# EAGLE schematic Wio LTE Cat NB1 v1.02 (EAGLE 6.4)
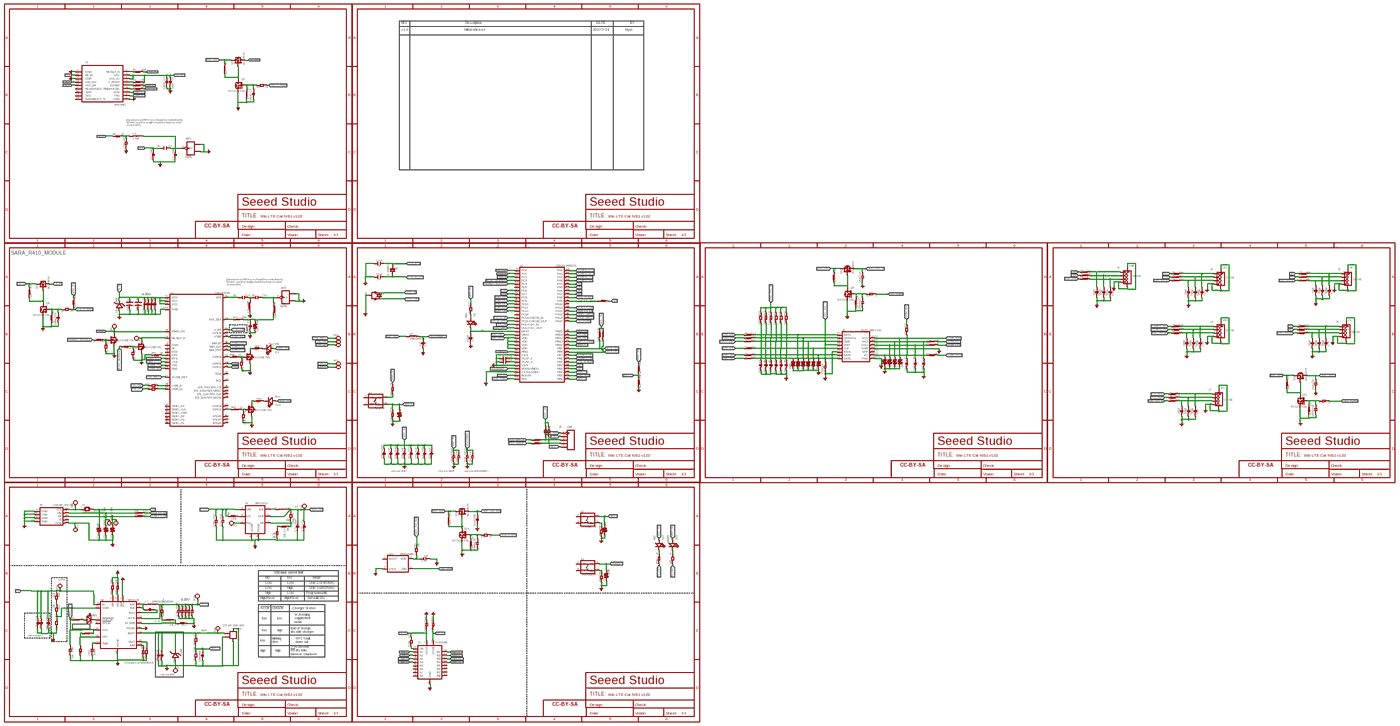
[diagram p0: schematic, sheet 1, overview]
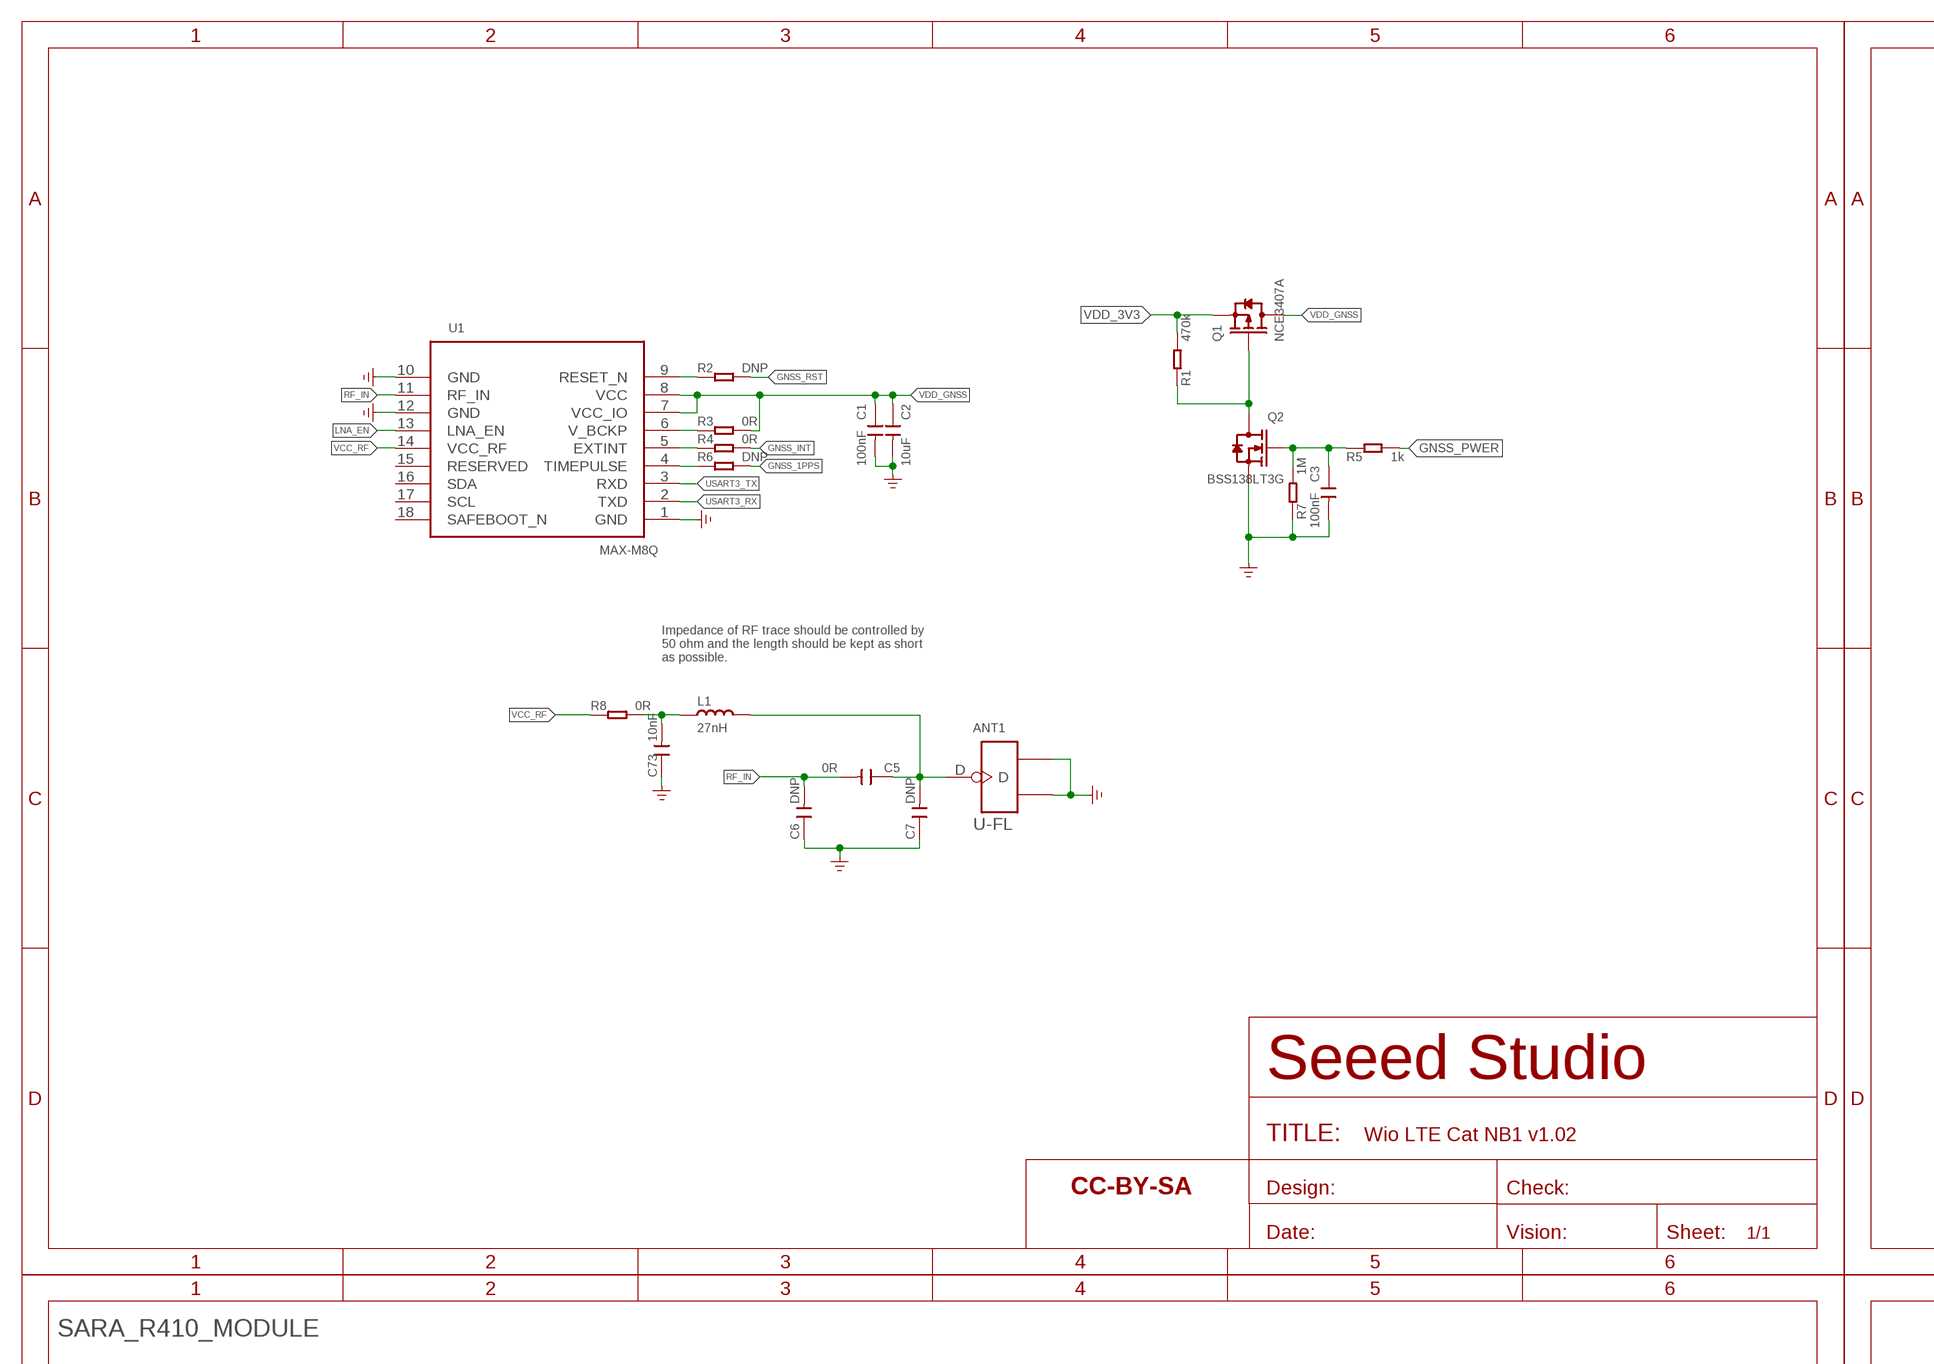
[diagram p1: schematic, sheet 1, part 1 of 6]
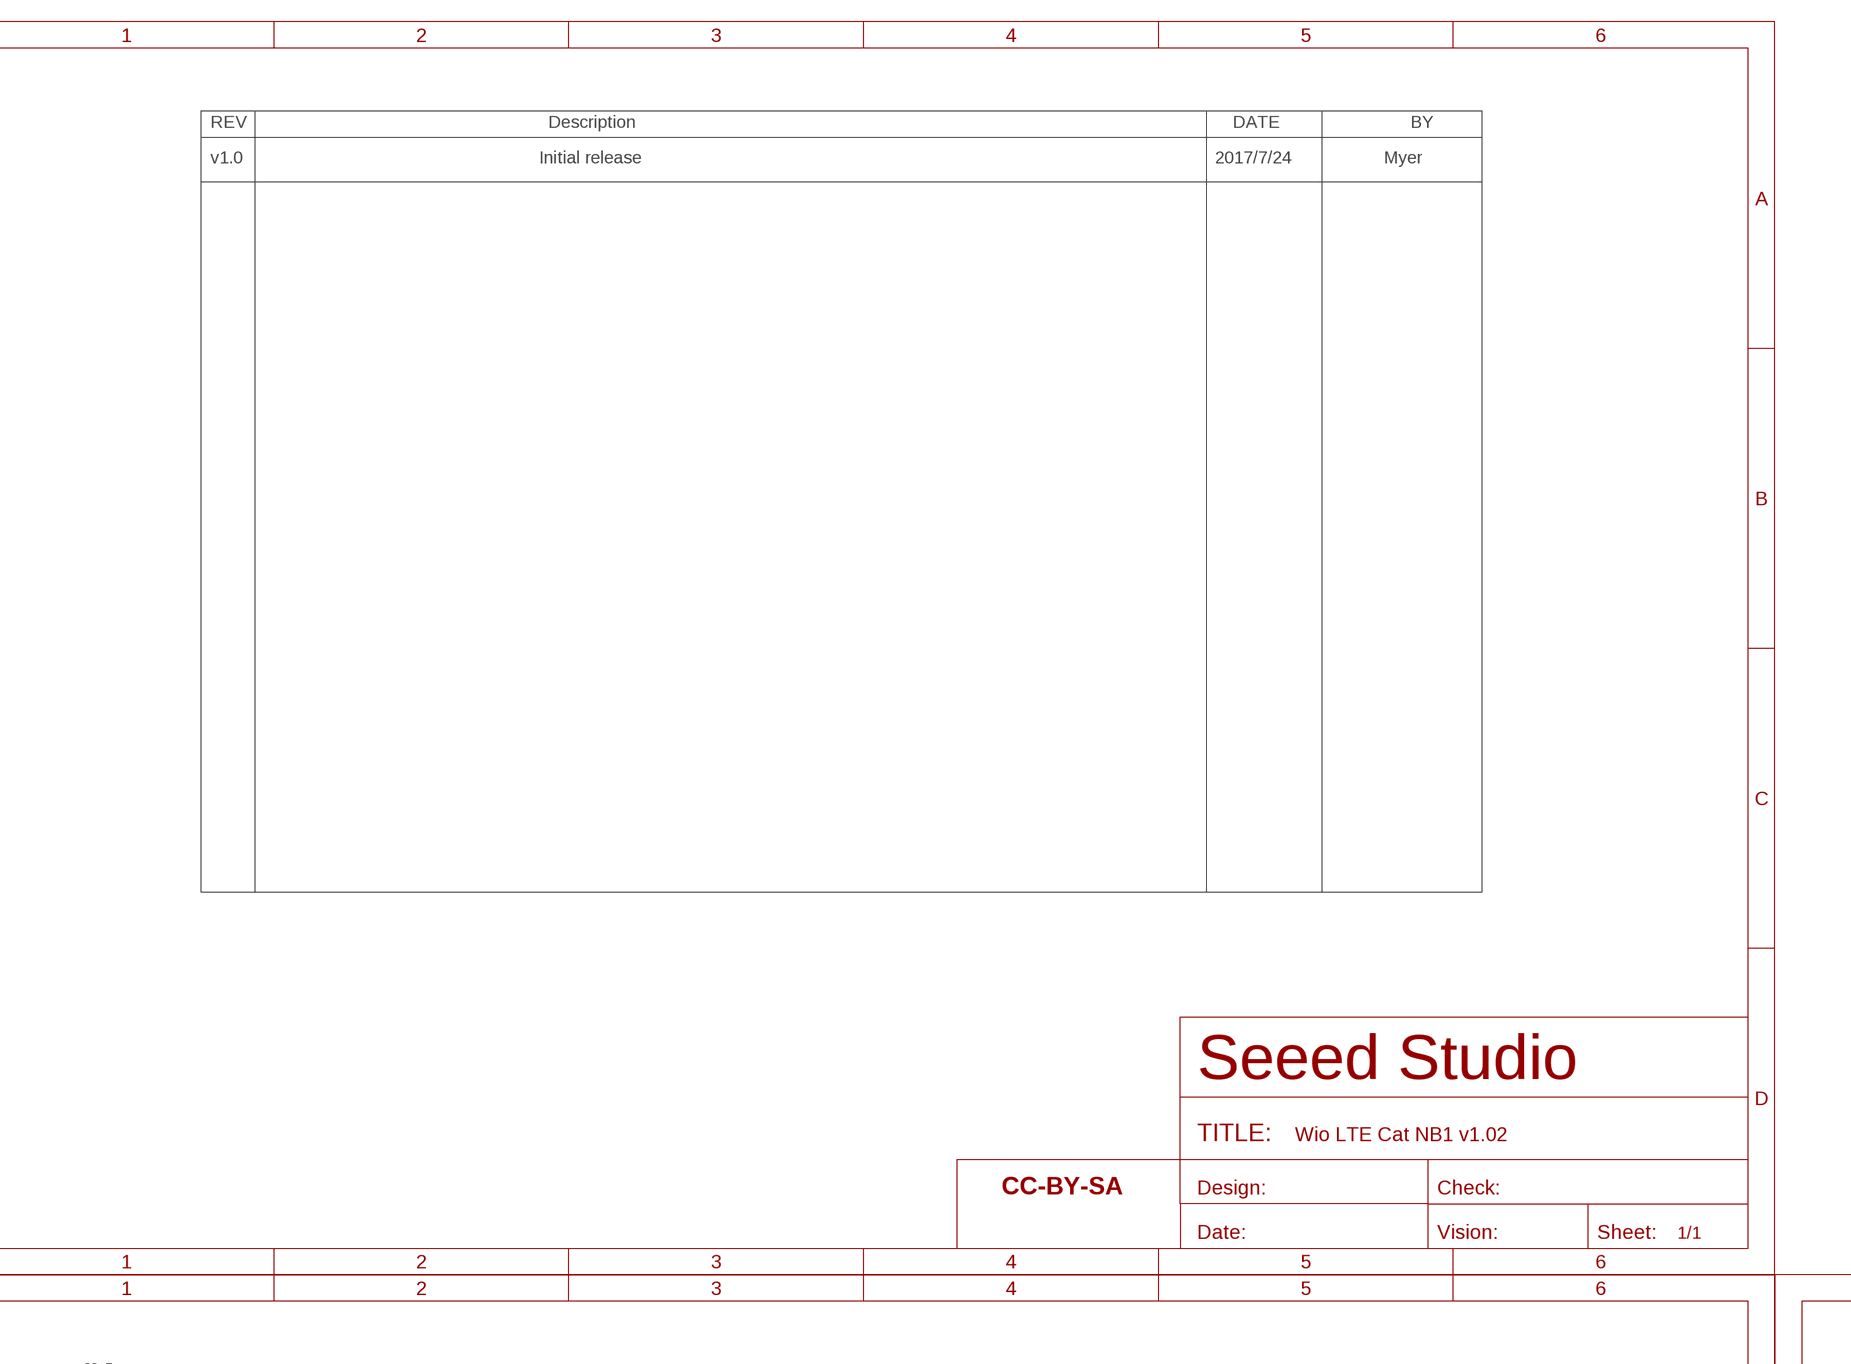
[diagram p2: schematic, sheet 1, part 2 of 6]
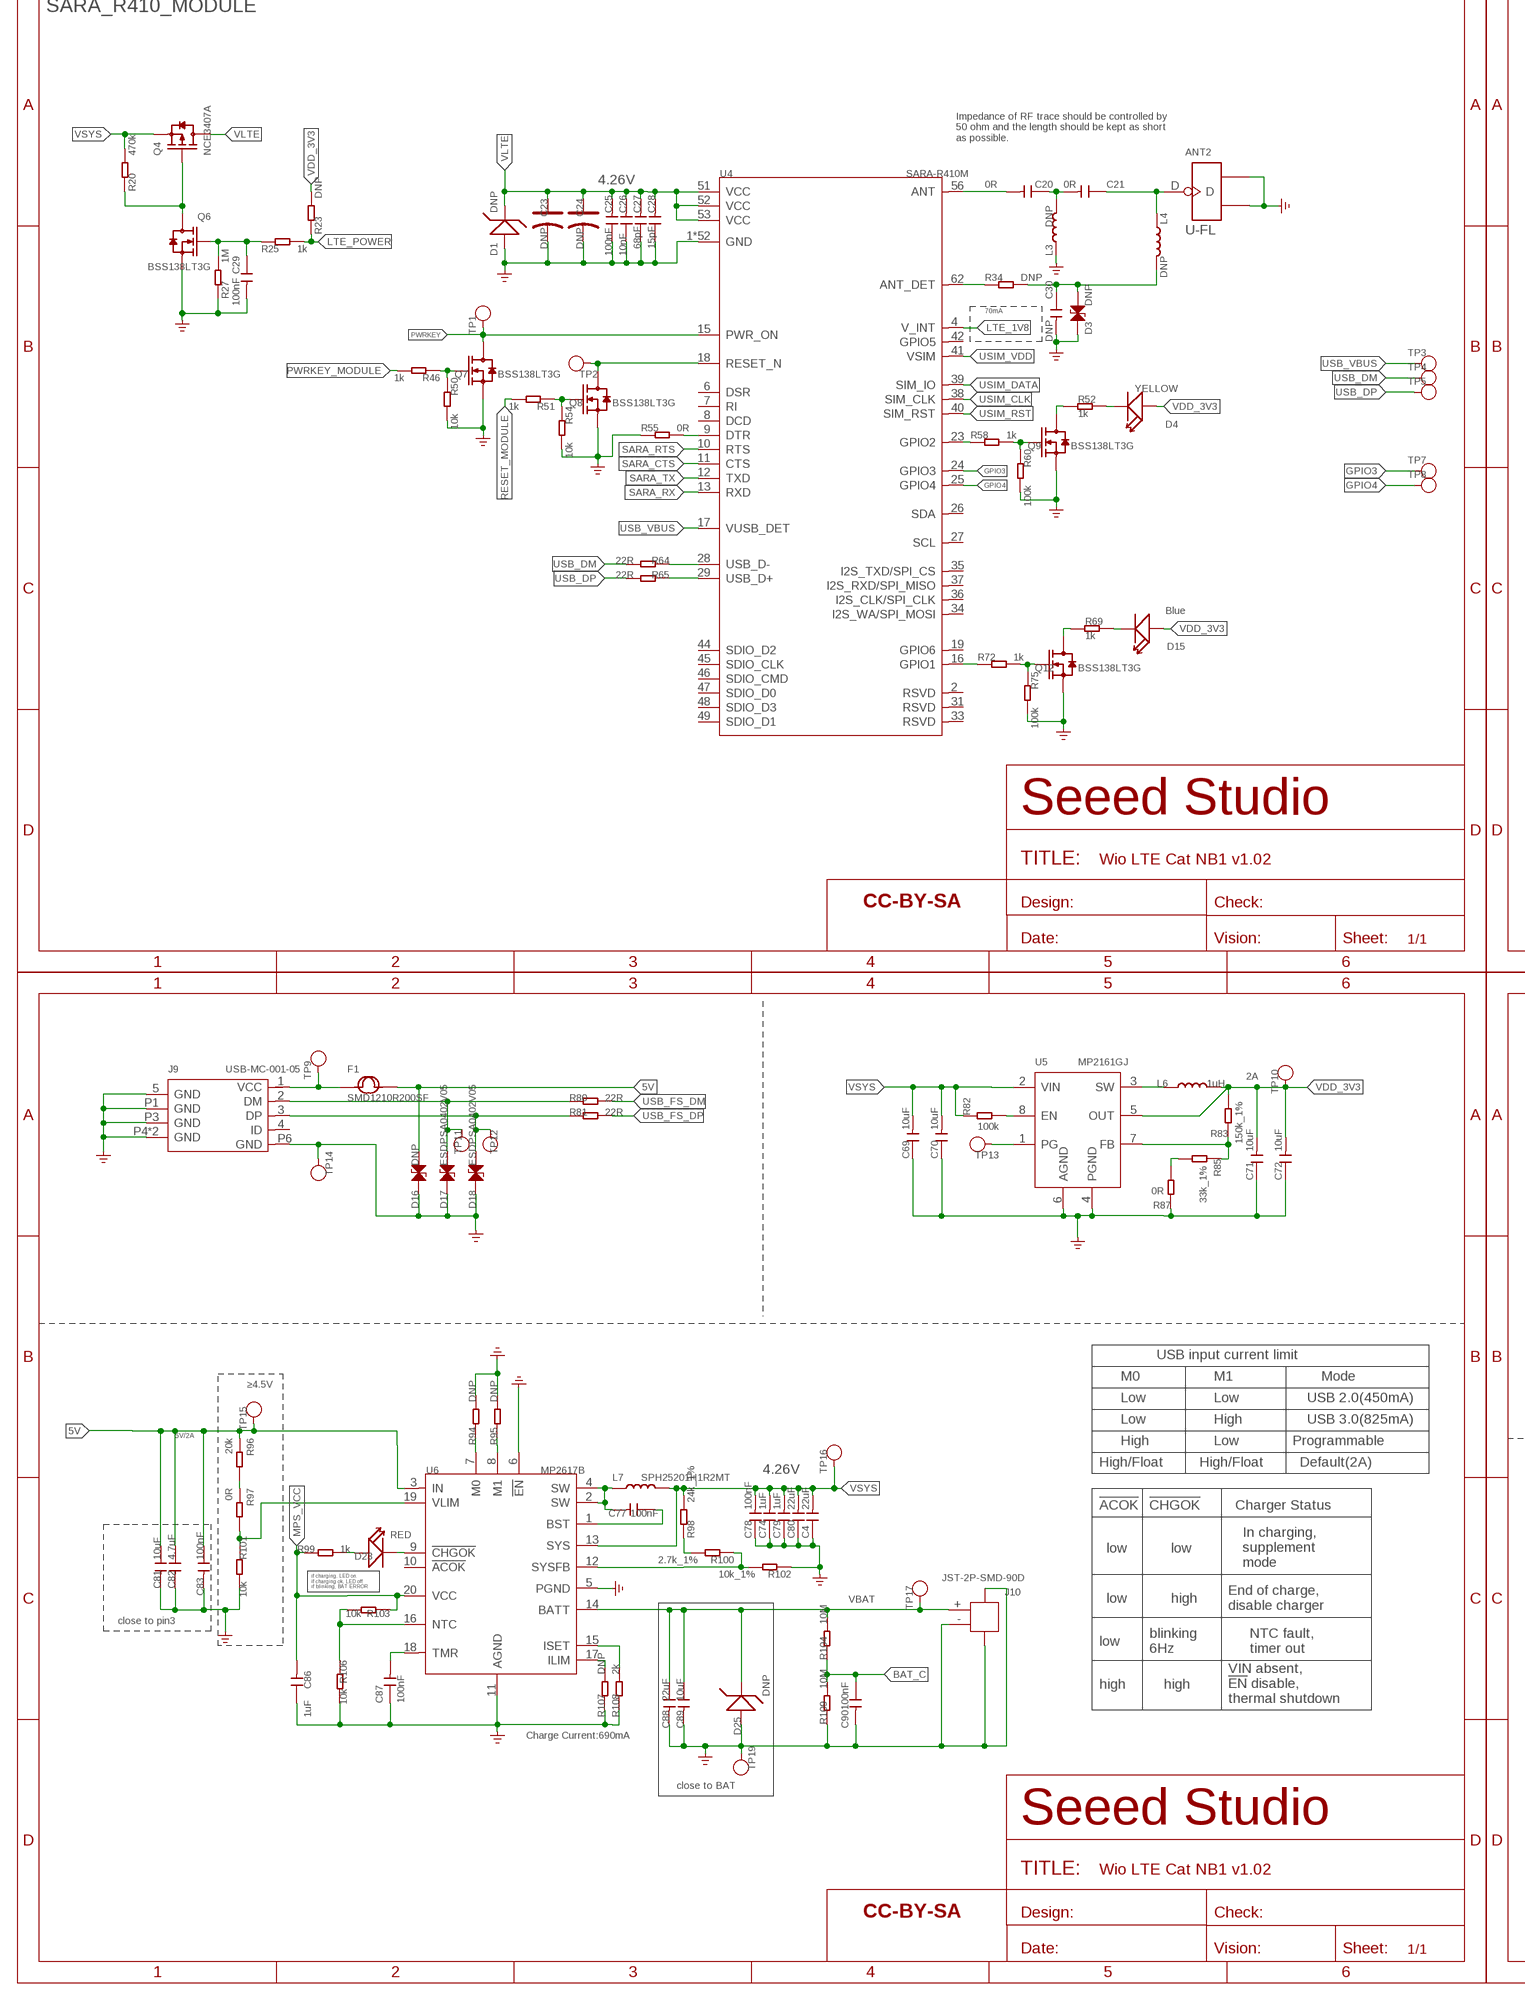
[diagram p3: schematic, sheet 1, part 3 of 6]
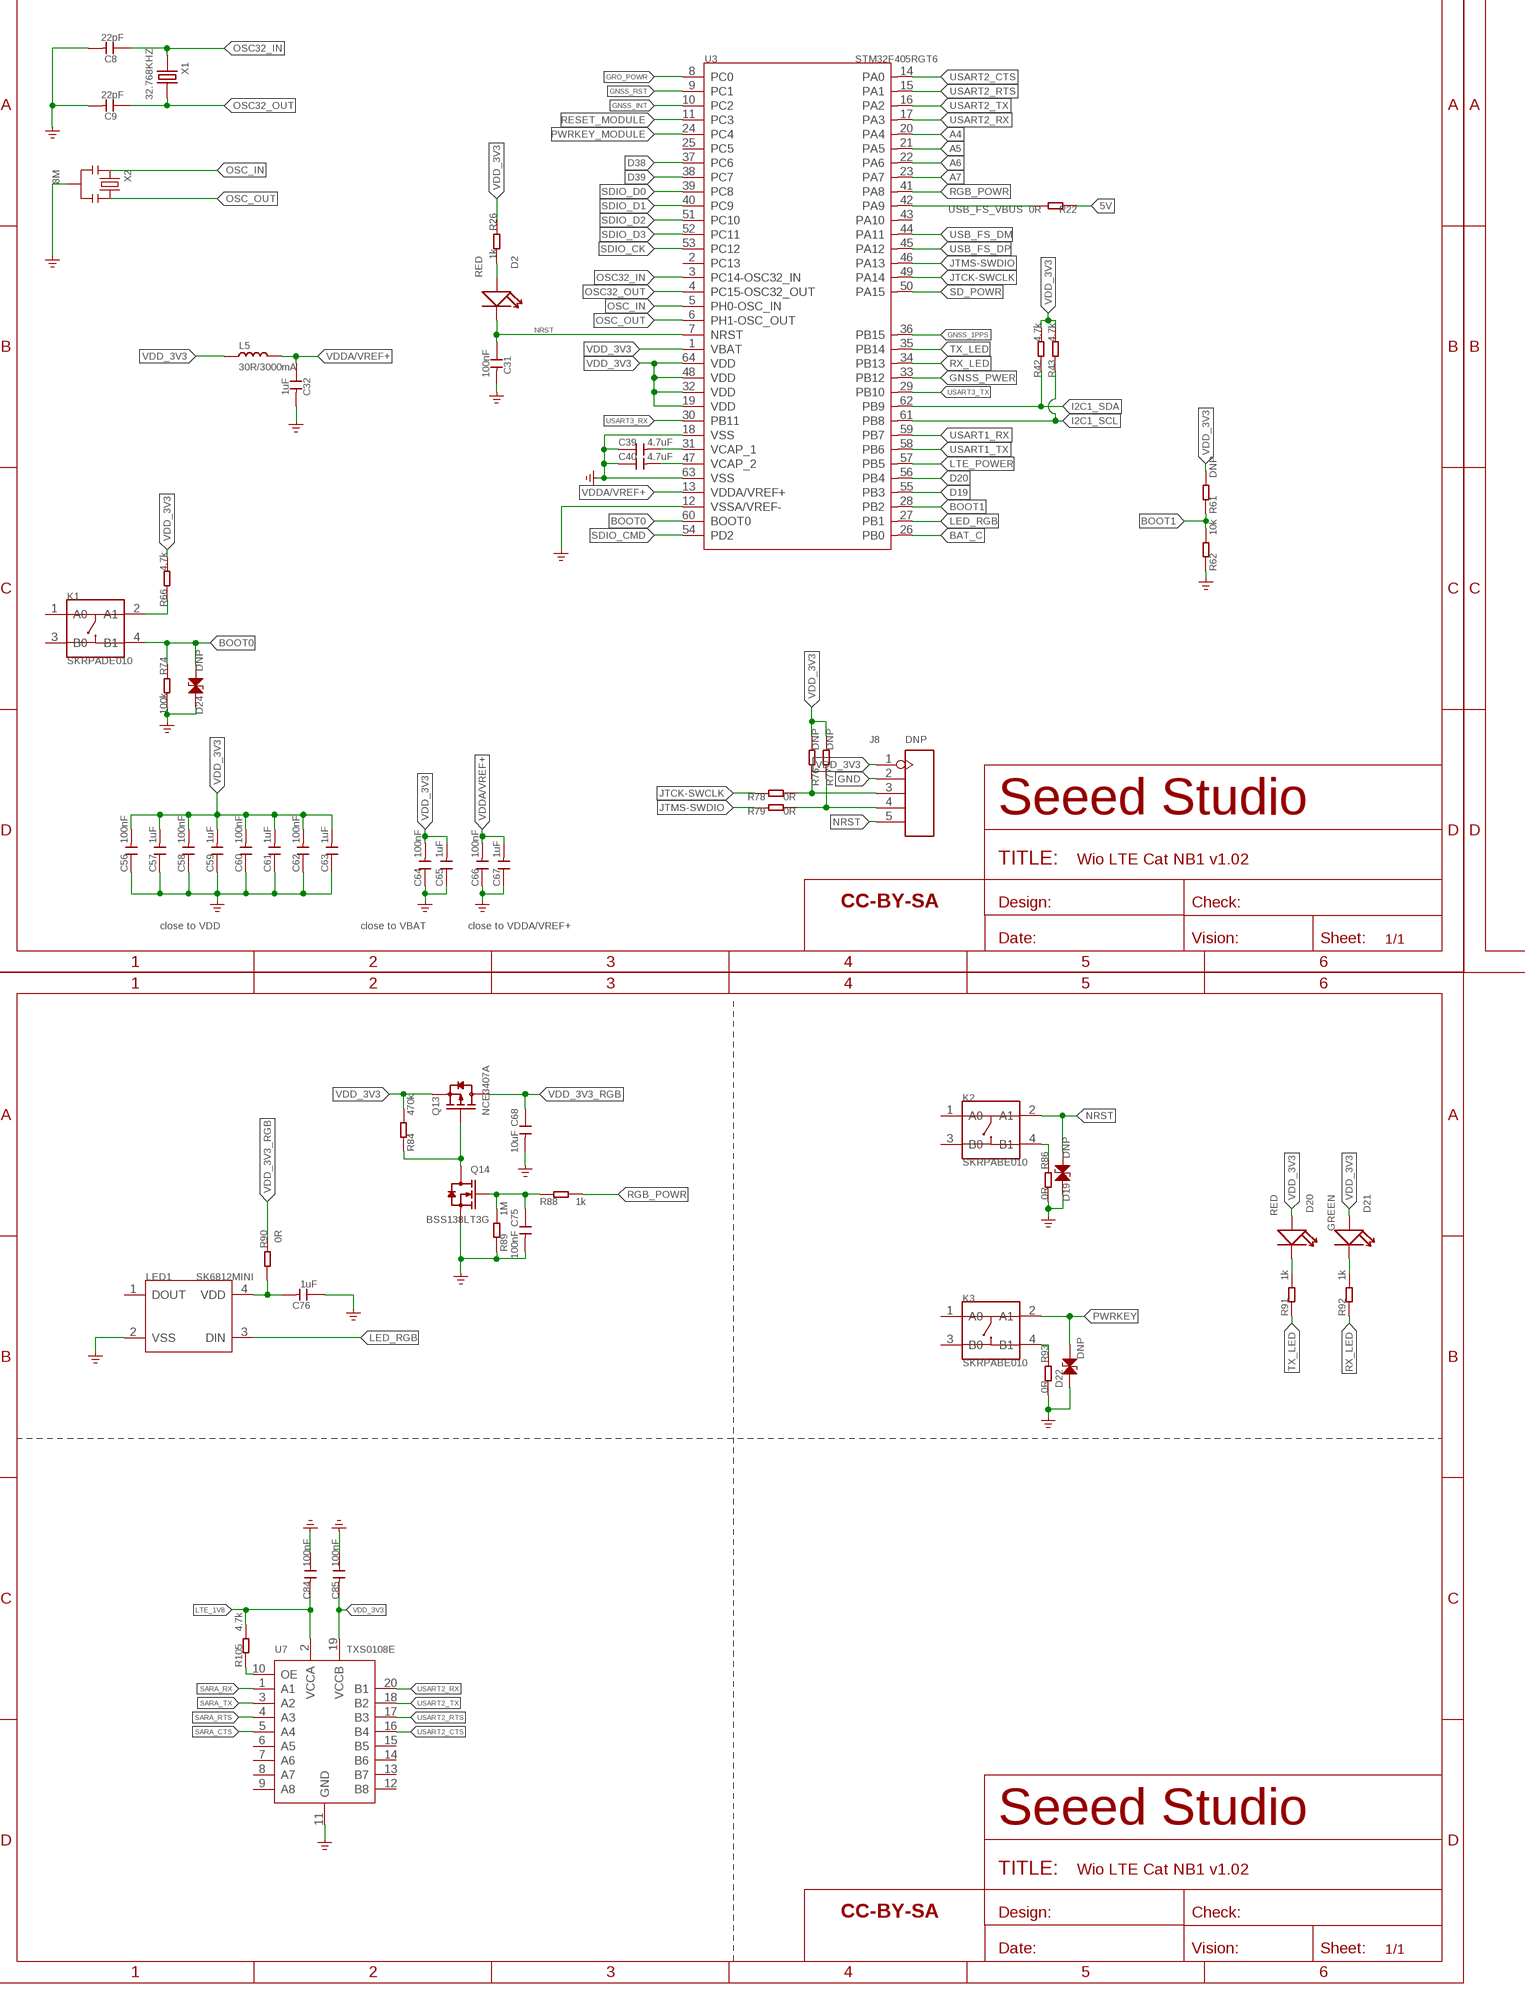
[diagram p4: schematic, sheet 1, part 4 of 6]
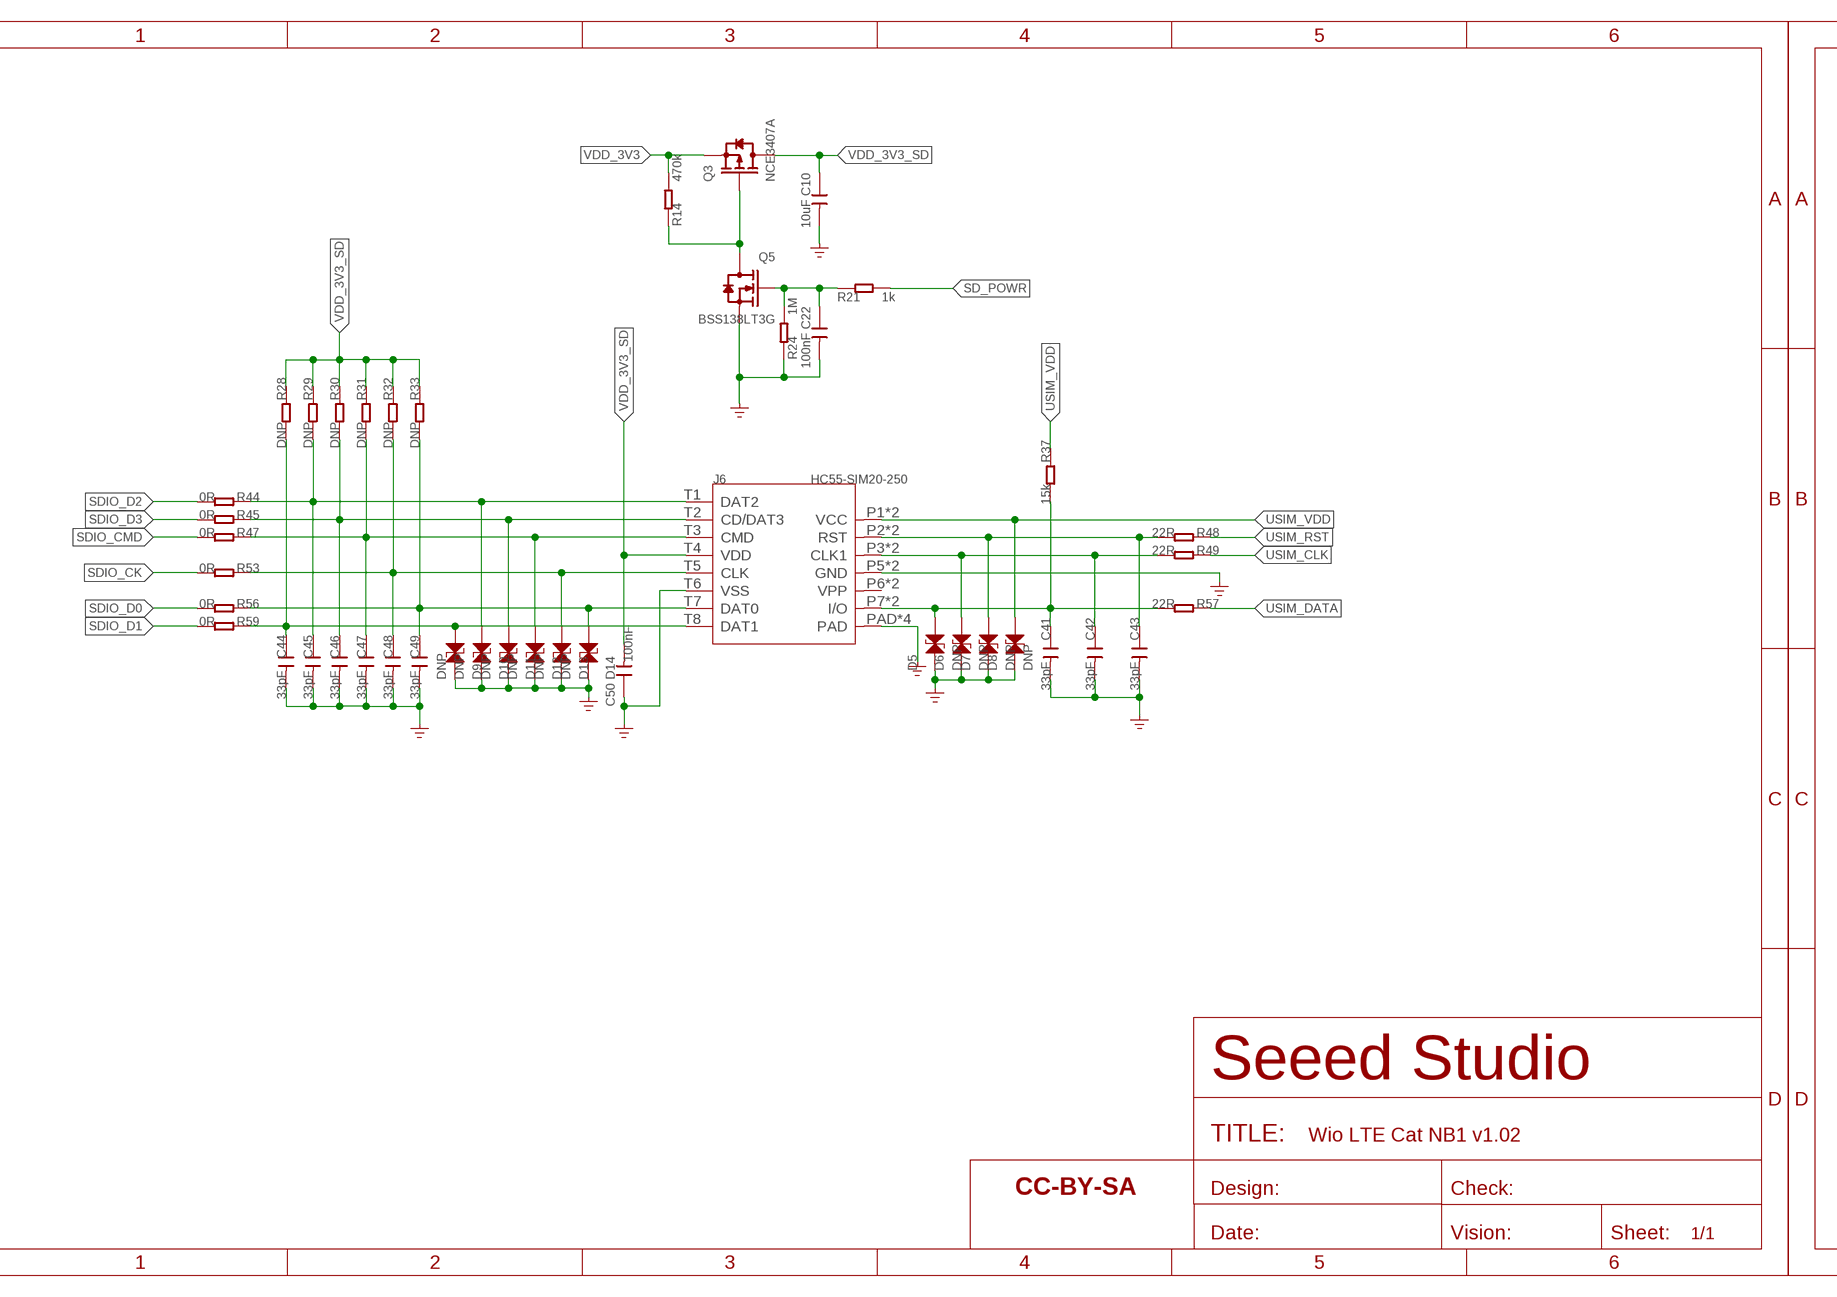
[diagram p5: schematic, sheet 1, part 5 of 6]
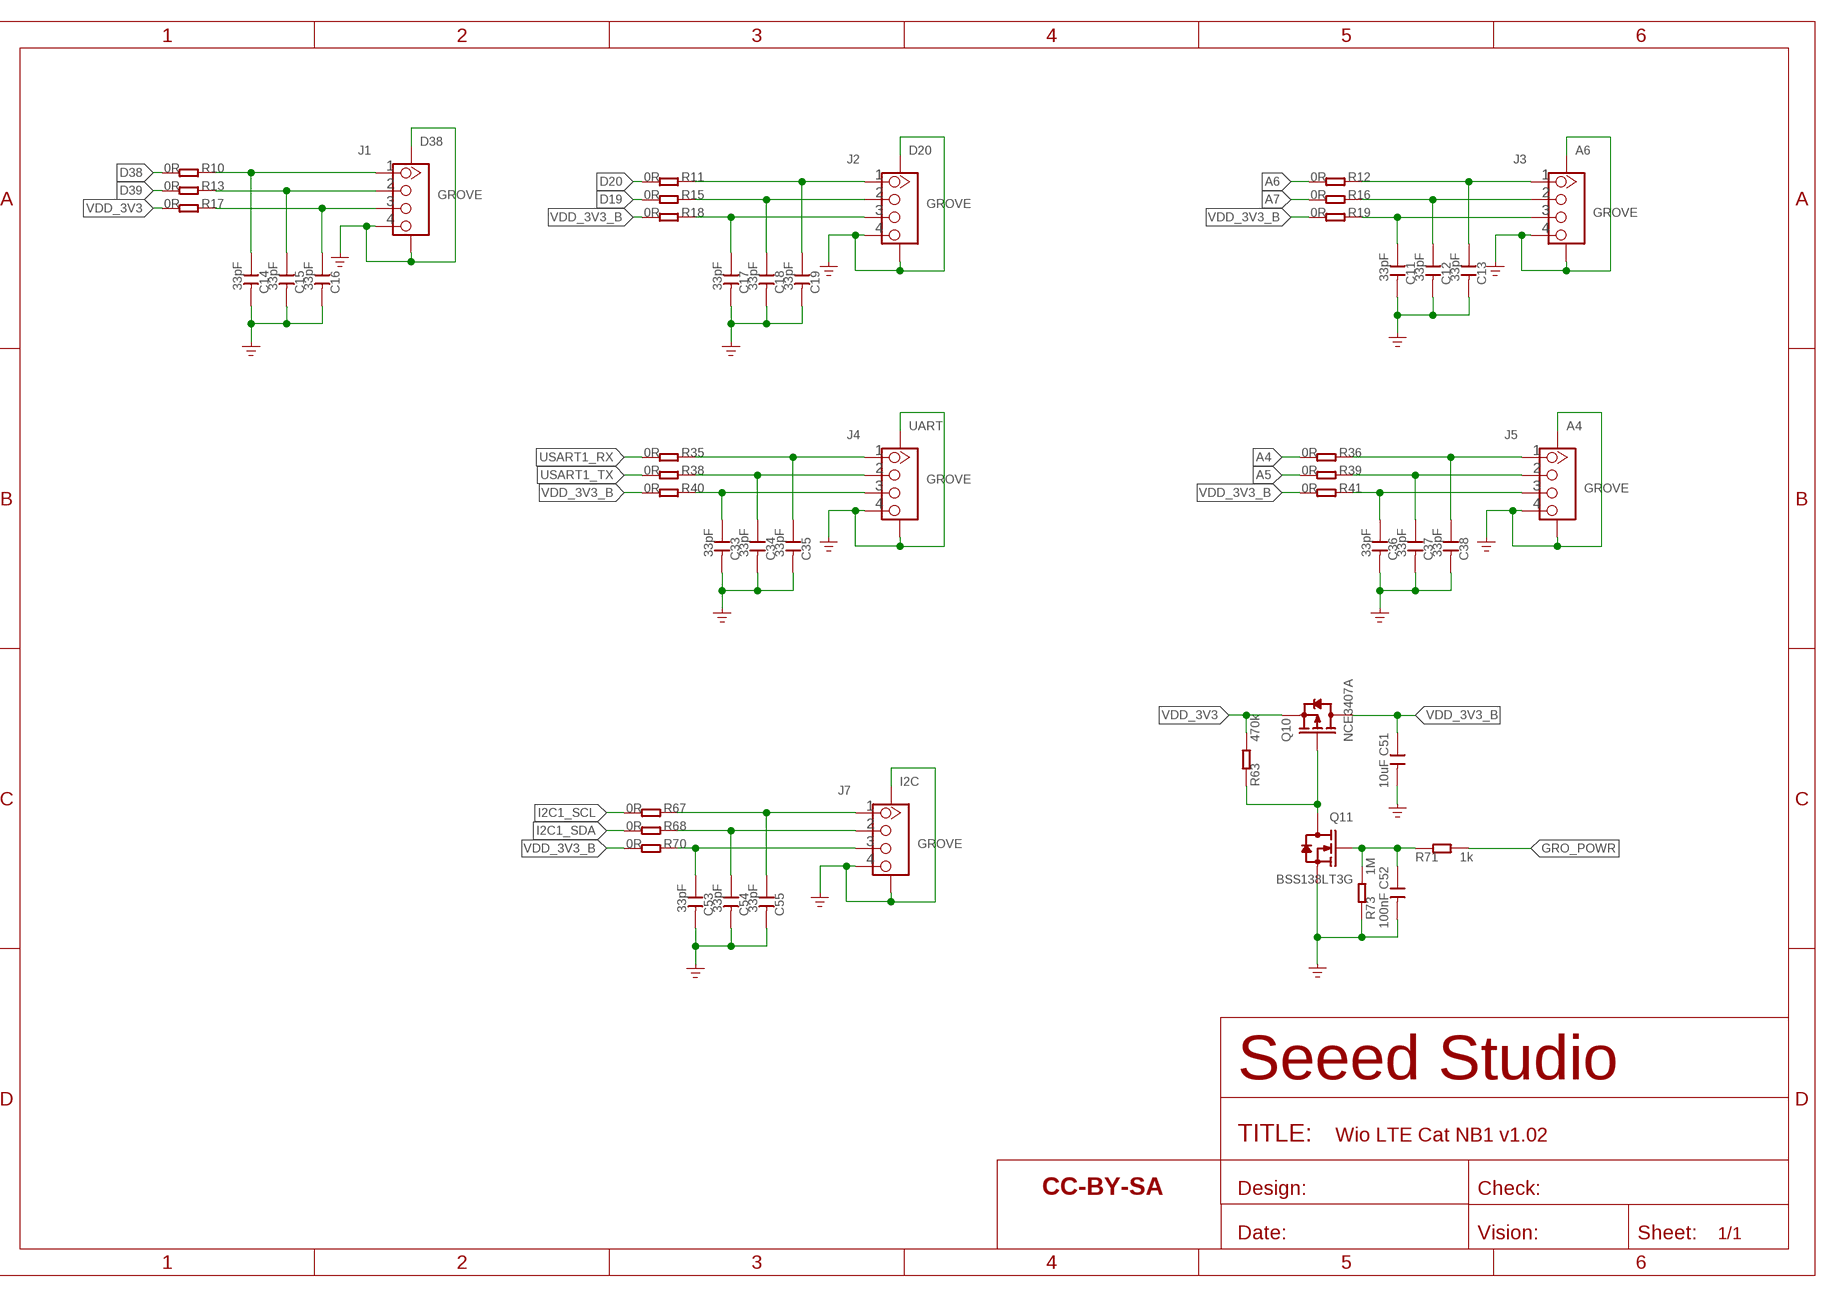
[diagram p6: schematic, sheet 1, part 6 of 6]

## Parts
ANT1  U-FL  ANTENNA-U-FL  [U-FL3P-SMD-2.6X2.6X1.0MM]
ANT2  U-FL  ANTENNA-U-FL  [U-FL3P-SMD-2.6X2.6X1.0MM]
C1  100nF  C-0402  [C0402]
C2  10uF  C-0603  [C0603]
C3  100nF  C-0402  [C0402]
C4  22uF  C-0805  [C0805]
C5  0R  C-0402  [C0402]
C6  DNP  C-0402  [C0402]
C7  DNP  C-0402  [C0402]
C8  22pF  C-0402  [C0402]
C9  22pF  C-0402  [C0402]
C10  10uF  C-0603  [C0603]
C11  33pF  C-0402  [C0402]
C12  33pF  C-0402  [C0402]
C13  33pF  C-0402  [C0402]
C14  33pF  C-0402  [C0402]
C15  33pF  C-0402  [C0402]
C16  33pF  C-0402  [C0402]
C17  33pF  C-0402  [C0402]
C18  33pF  C-0402  [C0402]
C19  33pF  C-0402  [C0402]
C20  0R  C-0402  [C0402]
C21  0R  C-0402  [C0402]
C22  100nF  C-0402  [C0402]
C23  DNP  CAP-POLAR-AVX-D  [AVX-D]
C24  DNP  CAP-POLAR-AVX-D  [AVX-D]
C25  100nF  C-0402  [C0402]
C26  10nF  C-0402  [C0402]
C27  68pF  C-0402  [C0402]
C28  15pF  C-0402  [C0402]
C29  100nF  C-0402  [C0402]
C30  DNP  C-0402  [C0402]
C31  100nF  C-0402  [C0402]
C32  1uF  C-0603  [C0603]
C33  33pF  C-0402  [C0402]
C34  33pF  C-0402  [C0402]
C35  33pF  C-0402  [C0402]
C36  33pF  C-0402  [C0402]
C37  33pF  C-0402  [C0402]
C38  33pF  C-0402  [C0402]
C39  4.7uF  C-0402  [C0402]
C40  4.7uF  C-0402  [C0402]
C41  33pF  C-0402  [C0402]
C42  33pF  C-0402  [C0402]
C43  33pF  C-0402  [C0402]
C44  33pF  C-0402  [C0402]
C45  33pF  C-0402  [C0402]
C46  33pF  C-0402  [C0402]
C47  33pF  C-0402  [C0402]
C48  33pF  C-0402  [C0402]
C49  33pF  C-0402  [C0402]
C50  100nF  C-0402  [C0402]
C51  10uF  C-0603  [C0603]
C52  100nF  C-0402  [C0402]
C53  33pF  C-0402  [C0402]
C54  33pF  C-0402  [C0402]
C55  33pF  C-0402  [C0402]
C56  100nF  C-0402  [C0402]
C57  1uF  C-0402  [C0402]
C58  100nF  C-0402  [C0402]
C59  1uF  C-0402  [C0402]
C60  100nF  C-0402  [C0402]
C61  1uF  C-0402  [C0402]
C62  100nF  C-0402  [C0402]
C63  1uF  C-0402  [C0402]
C64  100nF  C-0402  [C0402]
C65  1uF  C-0402  [C0402]
C66  100nF  C-0402  [C0402]
C67  1uF  C-0402  [C0402]
C68  10uF  C-0603  [C0603]
C69  10uF  C-0603  [C0603]
C70  10uF  C-0603  [C0603]
C71  10uF  C-0603  [C0603]
C72  10uF  C-0603  [C0603]
C73  10nF  C-0402  [C0402]
C74  1uF  C-0402  [C0402]
C75  100nF  C-0402  [C0402]
C76  1uF  C-0402  [C0402]
C77  100nF  C-0402  [C0402]
C78  100nF  C-0402  [C0402]
C79  1uF  C-0402  [C0402]
C80  22uF  C-0805  [C0805]
C81  10uF  C-0805  [C0805]
C82  4.7uF  C-0603  [C0603]
C83  100nF  C-0402  [C0402]
C84  100nF  C-0402  [C0402]
C85  100nF  C-0402  [C0402]
C86  1uF  C-0402  [C0402]
C87  100nF  C-0402  [C0402]
C88  22uF  C-0805  [C0805]
C89  10uF  C-0603  [C0603]
C90  100nF  C-0402  [C0402]
D1  DNP  D-ZENER-2P'MMSZ4689-V'  [SOD-123]
D2  RED  LED-0402  [LED-0402]
D3  DNP  D-ESD-2P-DOUBLE  [ESD-0402]
D4  YELLOW  LED-0402  [LED-0402]
D5  DNP  D-ESD-2P-DOUBLE  [ESD-0402]
D6  DNP  D-ESD-2P-DOUBLE  [ESD-0402]
D7  DNP  D-ESD-2P-DOUBLE  [ESD-0402]
D8  DNP  D-ESD-2P-DOUBLE  [ESD-0402]
D9  DNP  D-ESD-2P-DOUBLE  [ESD-0402]
D10  DNP  D-ESD-2P-DOUBLE  [ESD-0402]
D11  DNP  D-ESD-2P-DOUBLE  [ESD-0402]
D12  DNP  D-ESD-2P-DOUBLE  [ESD-0402]
D13  DNP  D-ESD-2P-DOUBLE  [ESD-0402]
D14  DNP  D-ESD-2P-DOUBLE  [ESD-0402]
D15  Blue  LED-0402  [LED-0402]
D16  DNP  D-ESD-2P-DOUBLE  [ESD-0402]
D17  ESDPSA0402V05  D-ESD-2P-DOUBLE  [ESD-0402]
D18  ESDPSA0402V05  D-ESD-2P-DOUBLE  [ESD-0402]
D19  DNP  D-ESD-2P-DOUBLE  [ESD-0402]
D20  RED  LED-0402  [LED-0402]
D21  GREEN  LED-0402  [LED-0402]
D22  DNP  D-ESD-2P-DOUBLE  [ESD-0402]
D23  RED  LED-0402  [LED-0402]
D24  DNP  D-ESD-2P-DOUBLE  [ESD-0402]
D25  DNP  D-ZENER-2P'BZX584CX'  [SOD-523]
F1  SMD1210R200SF  FUSE'1210'  [F1210]
FR1  SEEEDSTUDIO-OPEN-SCH-FRAME  [SEEEDSTUDIO-PCB-FRAME]
FR2  SEEEDSTUDIO-OPEN-SCH-FRAME  [SEEEDSTUDIO-PCB-FRAME]
FR3  SEEEDSTUDIO-OPEN-SCH-FRAME  [SEEEDSTUDIO-PCB-FRAME]
FR4  SEEEDSTUDIO-OPEN-SCH-FRAME  [SEEEDSTUDIO-PCB-FRAME]
FR5  SEEEDSTUDIO-OPEN-SCH-FRAME  [SEEEDSTUDIO-PCB-FRAME]
FR6  SEEEDSTUDIO-OPEN-SCH-FRAME  [SEEEDSTUDIO-PCB-FRAME]
FR7  SEEEDSTUDIO-OPEN-SCH-FRAME  [SEEEDSTUDIO-PCB-FRAME]
FR8  SEEEDSTUDIO-OPEN-SCH-FRAME  [SEEEDSTUDIO-PCB-FRAME]
J1  GROVE  GROVE-CONNECTOR-SMD'90D'  [HW4-SMD-2.0-90D]
J2  GROVE  GROVE-CONNECTOR-SMD'90D'  [HW4-SMD-2.0-90D]
J3  GROVE  GROVE-CONNECTOR-SMD'90D'  [HW4-SMD-2.0-90D]
J4  GROVE  GROVE-CONNECTOR-SMD'90D'  [HW4-SMD-2.0-90D]
J5  GROVE  GROVE-CONNECTOR-SMD'90D'  [HW4-SMD-2.0-90D]
J6  HC55-SIM20-250  NANO_SIM+TF-24P  [SIM+TF-24P-SMD-1.2-15.05X13.66X2.5MM]
J7  GROVE  GROVE-CONNECTOR-SMD'90D'  [HW4-SMD-2.0-90D]
J8  DNP  HEADER-5P-TEST  [H5-SMD-2.0-TEST]
J9  USB-MC-001-05  MICRO-USB5+4P  [MICRO-USB5+5P-SMD-0.65-7.2X5.06MM]
J10  JST-2P-SMD-90D  JST-2P-SMD'2.0'  [HW2-SMD-2.0-90D]
K1  SKRPADE010  BUTTON-4P-4.5X3.2  [SW4P-SMD-4.5X3.2X2.5MM]
K2  SKRPABE010  BUTTON-4P-4.5X3.2  [SW4P-SMD-4.5X3.2X2.5MM]
K3  SKRPABE010  BUTTON-4P-4.5X3.2  [SW4P-SMD-4.5X3.2X2.5MM]
L1  27nH  INDUCTOR/FERRITE-BEAD'0402'  [L0402]
L3  DNP  L-0402  [L0402]
L4  DNP  L-0402  [L0402]
L5  30R/3000mA  INDUCTOR/FERRITE-BEAD'0603'  [L0603]
L6  1uH  L-MPM201610SR33_T  [L201610]
L7  SPH25201H1R2MT  INDUCTOR/FERRITE-BEAD-2520  [L2520]
LED1  SK6812MINI  LED-RGB-4P-SK6812-SK6812  [LED4-1.75-3.7X3.5X0.95MM]
Q1  NCE3407A  MOSFET-P'SI2323CDS/SI2305DS<BR>'  [SOT-23]
Q2  BSS138LT3G  MOSFET-N'SOT23'  [SOT-23]
Q3  NCE3407A  MOSFET-P'SI2323CDS/SI2305DS<BR>'  [SOT-23]
Q4  NCE3407A  MOSFET-P'SI2323CDS/SI2305DS<BR>'  [SOT-23]
Q5  BSS138LT3G  MOSFET-N'SOT23'  [SOT-23]
Q6  BSS138LT3G  MOSFET-N'SOT23'  [SOT-23]
Q7  BSS138LT3G  MOSFET-N'SOT23'  [SOT-23]
Q8  BSS138LT3G  MOSFET-N'SOT23'  [SOT-23]
Q9  BSS138LT3G  MOSFET-N'SOT23'  [SOT-23]
Q10  NCE3407A  MOSFET-P'SI2323CDS/SI2305DS<BR>'  [SOT-23]
Q11  BSS138LT3G  MOSFET-N'SOT23'  [SOT-23]
Q12  BSS138LT3G  MOSFET-N'SOT23'  [SOT-23]
Q13  NCE3407A  MOSFET-P'SI2323CDS/SI2305DS<BR>'  [SOT-23]
Q14  BSS138LT3G  MOSFET-N'SOT23'  [SOT-23]
R1  470k  R-0402  [R0402]
R2  DNP  R-0402  [R0402]
R3  0R  R-0402  [R0402]
R4  0R  R-0402  [R0402]
R5  1k  R-0402  [R0402]
R6  DNP  R-0402  [R0402]
R7  1M  R-0402  [R0402]
R8  0R  R-0402  [R0402]
R10  0R  R-0402  [R0402]
R11  0R  R-0402  [R0402]
R12  0R  R-0402  [R0402]
R13  0R  R-0402  [R0402]
R14  470k  R-0402  [R0402]
R15  0R  R-0402  [R0402]
R16  0R  R-0402  [R0402]
R17  0R  R-0402  [R0402]
R18  0R  R-0402  [R0402]
R19  0R  R-0402  [R0402]
R20  470k  R-0402  [R0402]
R21  1k  R-0402  [R0402]
R22  0R  R-0402  [R0402]
R23  DNP  R-0402  [R0402]
R24  1M  R-0402  [R0402]
R25  1k  R-0402  [R0402]
R26  1k  R-0402  [R0402]
R27  1M  R-0402  [R0402]
R28  DNP  R-0402  [R0402]
R29  DNP  R-0402  [R0402]
R30  DNP  R-0402  [R0402]
R31  DNP  R-0402  [R0402]
R32  DNP  R-0402  [R0402]
R33  DNP  R-0402  [R0402]
R34  DNP  R-0402  [R0402]
R35  0R  R-0402  [R0402]
R36  0R  R-0402  [R0402]
R37  15k  R-0402  [R0402]
R38  0R  R-0402  [R0402]
R39  0R  R-0402  [R0402]
R40  0R  R-0402  [R0402]
R41  0R  R-0402  [R0402]
R42  4.7k  R-0402  [R0402]
R43  4.7k  R-0402  [R0402]
R44  0R  R-0402  [R0402]
R45  0R  R-0402  [R0402]
R46  1k  R-0402  [R0402]
R47  0R  R-0402  [R0402]
R48  22R  R-0402  [R0402]
R49  22R  R-0402  [R0402]
R50  10k  R-0402  [R0402]
R51  1k  R-0402  [R0402]
R52  1k  R-0402  [R0402]
R53  0R  R-0402  [R0402]
R54  10k  R-0402  [R0402]
R55  0R  R-0402  [R0402]
R56  0R  R-0402  [R0402]
R57  22R  R-0402  [R0402]
R58  1k  R-0402  [R0402]
R59  0R  R-0402  [R0402]
R60  100k  R-0402  [R0402]
R61  DNP  R-0402  [R0402]
R62  10k  R-0402  [R0402]
R63  470k  R-0402  [R0402]
R64  22R  R-0402  [R0402]
R65  22R  R-0402  [R0402]
R66  4.7k  R-0402  [R0402]
R67  0R  R-0402  [R0402]
R68  0R  R-0402  [R0402]
R69  1k  R-0402  [R0402]
R70  0R  R-0402  [R0402]
R71  1k  R-0402  [R0402]
R72  1k  R-0402  [R0402]
R73  1M  R-0402  [R0402]
R74  100k  R-0402  [R0402]
R75  100k  R-0402  [R0402]
R76  DNP  R-0402  [R0402]
R77  DNP  R-0402  [R0402]
R78  0R  R-0402  [R0402]
R79  0R  R-0402  [R0402]
R80  22R  R-0402  [R0402]
R81  22R  R-0402  [R0402]
R82  100k  R-0402  [R0402]
R83  150k_1%  R-0402  [R0402]
R84  470k  R-0402  [R0402]
R85  33k_1%  R-0402  [R0402]
R86  0R  R-0402  [R0402]
R87  0R  R-0402  [R0402]
R88  1k  R-0402  [R0402]
R89  1M  R-0402  [R0402]
R90  0R  R-0402  [R0402]
R91  1k  R-0402  [R0402]
R92  1k  R-0402  [R0402]
R93  0R  R-0402  [R0402]
R94  DNP  R-0402  [R0402]
R95  DNP  R-0402  [R0402]
R96  20k  R-0402  [R0402]
R97  0R  R-0402  [R0402]
R98  24k_1%  R-0402  [R0402]
R99  1k  R-0402  [R0402]
R100  2.7k_1%  R-0402  [R0402]
R101  10k  R-0402  [R0402]
R102  10k_1%  R-0402  [R0402]
R103  10k  R-0402  [R0402]
R104  10M  R-0402  [R0402]
R105  4.7k  R-0402  [R0402]
R106  10k  R-0402  [R0402]
R107  DNP  R-0402  [R0402]
R108  2k  R-0402  [R0402]
R109  10M  R-0402  [R0402]
TP1  TEST-POINT'4545'  [TP-D45MIL]
TP2  TEST-POINT'4545'  [TP-D45MIL]
TP3  TEST-POINT'4545'  [TP-D45MIL]
TP4  TEST-POINT'4545'  [TP-D45MIL]
TP5  TEST-POINT'4545'  [TP-D45MIL]
TP7  TEST-POINT'4545'  [TP-D45MIL]
TP8  TEST-POINT'4545'  [TP-D45MIL]
TP9  TEST-POINT'4545'  [TP-D45MIL]
TP10  TEST-POINT'4545'  [TP-D45MIL]
TP11  TEST-POINT'4545'  [TP-D45MIL]
TP12  TEST-POINT'4545'  [TP-D45MIL]
TP13  TEST-POINT'4545'  [TP-D45MIL]
TP14  TEST-POINT'4545'  [TP-D45MIL]
TP15  TEST-POINT'4545'  [TP-D45MIL]
TP16  TEST-POINT'4545'  [TP-D45MIL]
TP17  TEST-POINT'4545'  [TP-D45MIL]
TP19  TEST-POINT'4545'  [TP-D45MIL]
U1  MAX-M8Q  MOUDLE-GPS-MAX-M8  [LGA18-1.1-9.7X10.1X2.5MM]
U3  STM32F405RGT6  MCU-STM32F412-64P  [LQFP64]
U4  SARA-R410M  MOUDLE-GSM/EGPRS-SARA-R4  [MOUDLE96P-SMD-1.1-26X16X2.53MM]
U5  MP2161GJ  PMIC-MP2161'GJ'  [TSOT23-8]
U6  MP2617B  PMIC-MP2617  [QFN20-0.5-3X4X1MM]
U7  TXS0108E  LOGIC-TXS0108EPWR  [TSSOP20-0.65-6.5X4.4MM]
X1  32.768KHZ  CRYSTAL-2P'NX2012SA'  [X2-SMD-L2.0X1.2X0.55MM]
X2  8M  CRYSTAL-RESONATOR'SMD'  [RESONATOR3-SMD-3.6X1.3X0.8MM]

## Nets
5V: C81.1 C82.1 C83.1 D16.2 F1.2 R22.1 R96.1 TP15.T U6.3(IN)
A4: R36.2 U3.20(PA4)
A5: R39.2 U3.21(PA5)
A6: R12.2 U3.22(PA6)
A7: R16.2 U3.23(PA7)
BAT_C: C90.1 R104.1 R109.2 U3.26(PB0)
BOOT0: D24.2 K1.4(B1) R74.1 U3.60(BOOT0)
BOOT1: R61.1 R62.2 U3.28(PB2)
CD/DATA3: C46.1 D11.2 J6.T2(CD/DAT3) R30.2 R45.1
D19: R15.2 U3.55(PB3)
D20: R11.2 U3.56(PB4)
D38: R10.2 U3.37(PC6)
D39: R13.2 U3.38(PC7)
GND: ANT1.GND1 ANT1.GND2 ANT2.GND1 ANT2.GND2 C1.2 C2.2 C3.2 C4.1 C6.1 C7.1 C8.2 C9.2 C10.2 C11.2 C12.2 C13.2 C14.2 C15.2 C16.2 C17.2 C18.2 C19.2 C22.2 C23.- C24.- C25.1 C26.1 C27.1 C28.1 C29.2 C30.2 C31.2 C32.2 C33.2 C34.2 C35.2 C36.2 C37.2 C38.2 C39.1 C40.1 C41.2 C42.2 C43.2 C44.2 C45.2 C46.2 C47.2 C48.2 C49.2 C50.1 C51.2 C52.2 C53.2 C54.2 C55.2 C56.1 C57.1 C58.1 C59.1 C60.1 C61.1 C62.1 C63.1 C64.1 C65.1 C66.1 C67.1 C68.2 C69.1 C70.1 C71.1 C72.1 C73.1 C74.1 C75.2 C76.1 C78.1 C79.1 C80.1 C81.2 C82.2 C83.2 C84.1 C85.1 C86.1 C87.1 C88.2 C89.2 C90.2 D1.+ D3.1 D5.1 D6.1 D7.1 D8.1 D9.1 D10.1 D11.1 D12.1 D13.1 D14.1 D16.1 D17.1 D18.1 D19.1 D22.1 D24.1 D25.+ J1.4 J1.SS1 J1.SS2 J2.4 J2.SS1 J2.SS2 J3.4 J3.SS1 J3.SS2 J4.4 J4.SS1 J4.SS2 J5.4 J5.SS1 J5.SS2 J6.P5(GND) J6.P5B(GND) J6.PAD J6.PAD1(PAD) J6.PAD2(PAD) J6.PAD3(PAD) J6.T6(VSS) J7.4 J7.SS1 J7.SS2 J8.2 J9.5(GND) J9.P1(GND) J9.P3(GND) J9.P4(GND) J9.P5(GND) J9.P6(GND) J10.3 J10.4 J10.- L3.1 LED1.2(VSS) Q2.2(S) Q5.2(S) Q6.2(S) Q7.2(S) Q8.2(S) Q9.2(S) Q11.2(S) Q12.2(S) Q14.2(S) R7.1 R24.1 R27.1 R50.2 R54.2 R55.1 R60.2 R62.1 R73.1 R74.2 R75.2 R86.2 R87.1 R89.1 R93.2 R94.2 R95.2 R101.2 R102.1 R106.2 R107.1 R108.1 R109.1 TP14.T TP19.T U1.1(GND) U1.10(GND) U1.12(GND) U3.12(VSSA/VREF-) U3.18(VSS) U3.63(VSS) U4.1(GND) U4.3(GND) U4.5(GND) U4.14(GND) U4.20(GND) U4.21(GND) U4.22(GND) U4.30(GND) U4.32(GND) U4.43(GND) U4.50(GND) U4.54(GND) U4.55(GND) U4.57(GND) U4.58(GND) U4.59(GND) U4.60(GND) U4.61(GND) U4.63(GND) U4.64(GND) U4.65(GND) U4.66(GND) U4.67(GND) U4.68(GND) U4.69(GND) U4.70(GND) U4.71(GND) U4.72(GND) U4.73(GND) U4.74(GND) U4.75(GND) U4.76(GND) U4.77(GND) U4.78(GND) U4.79(GND) U4.80(GND) U4.81(GND) U4.82(GND) U4.83(GND) U4.84(GND) U4.85(GND) U4.86(GND) U4.87(GND) U4.88(GND) U4.89(GND) U4.90(GND) U4.91(GND) U4.92(GND) U4.93(GND) U4.94(GND) U4.95(GND) U4.96(GND) U5.4(PGND) U5.6(AGND) U6.5(PGND) U6.6(!EN) U6.11(AGND) U7.11(GND) X2.2 ; supply symbol labelled GND_POWER
GNSS_1PPS: R6.2 U3.36(PB15)
GNSS_INT: R4.2 U3.10(PC2)
GNSS_PWER: R5.2 U3.33(PB12)
GNSS_RST: R2.2 U3.9(PC1)
GPIO3: TP7.T U4.24(GPIO3)
GPIO4: TP8.T U4.25(GPIO4)
GRO_POWR: R71.2 U3.8(PC0)
I2C1_SCL: R43.1 R67.2 U3.61(PB8)
I2C1_SDA: R42.1 R68.2 U3.62(PB9)
JTCK-SWCLK: R78.1 U3.49(PA14)
JTMS-SWDIO: R79.1 U3.46(PA13)
LED_RGB: LED1.3(DIN) U3.27(PB1)
LNA_EN: U1.13(LNA_EN)
LTE_1V8: C84.2 R105.2 U4.4(V_INT) U7.2(VCCA)
LTE_POWER: R23.1 R25.2 U3.57(PB5)
MPS_VCC: C86.2 R99.1 R103.1 U6.20(VCC)
N$1: C73.2 L1.1 R8.2
N$5: TP13.T U5.1(PG)
N$6: K3.4(B1) R93.1
N$7: R64.1 U4.28(USB_D-)
N$8: R65.1 U4.29(USB_D+)
N$9: D20.- R91.2
N$10: C76.2 LED1.4(VDD) R90.2
N$11: C75.1 Q14.1(G) R88.1 R89.2
N$12: R103.2 R106.1 U6.16(NTC)
N$13: C20.2 U4.56(ANT)
N$14: D2.+ R26.2
N$15: K2.4(B1) R86.1
N$16: Q13.1(G) Q14.3(D) R84.1
N$17: Q7.1(G) R46.1 R50.1
N$18: C39.2 U3.31(VCAP_1)
N$19: C40.2 U3.47(VCAP_2)
N$20: J8.3 R76.1 R78.2
N$21: J8.4 R77.1 R79.2
N$22: R98.1 R100.2
N$23: R100.1 R102.2 U6.12(SYSFB)
N$24: F1.1 J9.1(VCC) TP9.T
N$25: Q4.1(G) Q6.3(D) R20.1
N$26: C29.1 Q6.1(G) R25.1 R27.2
N$27: Q8.1(G) R51.1 R54.1
N$28: Q8.3(D) TP2.T U4.18(RESET_N)
N$29: Q12.1(G) R72.2 R75.1
N$30: C87.2 U6.18(TMR)
N$31: K1.2(A1) R66.1
N$32: C77.2 L7.1 U6.2(SW) U6.4(SW)
N$33: C45.1 D10.2 J6.T1(DAT2) R29.2 R44.1
N$34: C44.1 D9.2 J6.T8(DAT1) R28.2 R59.1
N$35: R107.2 U6.17(ILIM)
N$36: R108.2 U6.15(ISET)
N$37: R72.1 U4.16(GPIO1)
N$38: R58.1 U4.23(GPIO2)
N$39: C77.1 U6.1(BST)
N$40: C53.1 J7.3 R70.1
N$42: R96.2 R97.1
N$43: C54.1 J7.2 R68.1
N$44: Q9.1(G) R58.2 R60.1
N$45: C55.1 J7.1 R67.1
N$46: R55.2 U4.9(DTR)
N$47: C16.1 J1.3 R17.1
N$49: R85.2 R87.2
N$50: L6.1 U5.3(SW)
N$51: Q9.3(D) R52.1
N$52: C15.1 J1.2 R13.1
N$53: D18.2 J9.3(DP) R81.1 TP12.T
N$54: C14.1 J1.1 R10.1
N$55: D17.2 J9.2(DM) R80.1 TP11.T
N$56: D21.- R92.2
N$57: Q12.3(D) R69.1
N$58: C20.1 C21.2 L3.2
N$59: C43.1 D7.2 J6.P2(RST) J6.P2B(RST) R48.2
N$60: C42.1 D6.2 J6.P3(CLK1) J6.P3B(CLK1) R49.2
N$61: R34.1 U4.62(ANT_DET)
N$62: C41.1 D5.2 J6.P7(I/O) J6.P7B(I/O) R37.2 R57.2
N$63: C17.1 J2.3 R18.1
N$64: C18.1 J2.2 R15.1
N$65: C19.1 J2.1 R11.1
N$66: C30.1 D3.2 L4.2 R34.2
N$67: C11.1 J3.3 R19.1
N$68: Q3.1(G) Q5.3(D) R14.1
N$69: C12.1 J3.2 R16.1
N$70: C13.1 J3.1 R12.1
N$71: C33.1 J4.3 R40.1
N$72: R82.2 U5.8(EN)
N$73: C34.1 J4.2 R38.1
N$74: C35.1 J4.1 R35.1
N$75: C36.1 J5.3 R41.1
N$76: C37.1 J5.2 R39.1
N$77: C38.1 J5.1 R36.1
N$78: R83.1 R85.1 U5.7(FB)
N$82: Q10.1(G) Q11.3(D) R63.1
N$83: C52.1 Q11.1(G) R71.1 R73.2
N$84: R97.2 R101.1 U6.19(VLIM)
N$86: R94.1 U6.7(M0)
N$91: R95.1 U6.8(M1)
N$98: C22.1 Q5.1(G) R21.1 R24.2
N$100: Q1.1(G) Q2.3(D) R1.1
N$101: D23.- U6.9(!CHGOK)
N$102: D23.+ R99.2
N$103: ANT1.D C5.1 C7.2 L1.2
N$104: ANT2.D C21.1 L4.1
N$105: D4.- R52.2
N$106: R2.1 U1.9(RESET_N)
N$108: R3.1 U1.6(V_BCKP)
N$109: R4.1 U1.5(EXTINT)
N$110: R6.1 U1.4(TIMEPULSE)
N$111: D15.- R69.2
N$113: C3.1 Q2.1(G) R5.1 R7.2
NRST: C31.1 D2.- D19.2 J8.5 K2.2(A1) U3.7(NRST)
OE: R105.1 U7.10(OE)
OSC32_IN: C8.1 U3.3(PC14-OSC32_IN) X1.1
OSC32_OUT: C9.1 U3.4(PC15-OSC32_OUT) X1.2
OSC_IN: U3.5(PH0-OSC_IN) X2.1
OSC_OUT: U3.6(PH1-OSC_OUT) X2.3
PWRKEY: D22.2 K3.2(A1) Q7.3(D) TP1.T U4.15(PWR_ON)
PWRKEY_MODULE: R46.2 U3.24(PC4)
RESET_MODULE: R51.2 U3.11(PC3)
RF_IN: C5.2 C6.2 U1.11(RF_IN)
RGB_POWR: R88.2 U3.41(PA8)
RX_LED: R92.1 U3.34(PB13)
SARA_CTS: U4.11(CTS) U7.5(A4)
SARA_RTS: U4.10(RTS) U7.4(A3)
SARA_RX: U4.13(RXD) U7.1(A1)
SARA_TX: U4.12(TXD) U7.3(A2)
SD_CLK: C48.1 D13.2 J6.T5(CLK) R32.2 R53.1
SD_CMD: C47.1 D12.2 J6.T3(CMD) R31.2 R47.1
SD_DATA0: C49.1 D14.2 J6.T7(DAT0) R33.2 R56.1
SD_POWR: R21.2 U3.50(PA15)
SDIO_CK: R53.2 U3.53(PC12)
SDIO_CMD: R47.2 U3.54(PD2)
SDIO_D0: R56.2 U3.39(PC8)
SDIO_D1: R59.2 U3.40(PC9)
SDIO_D2: R44.2 U3.51(PC10)
SDIO_D3: R45.2 U3.52(PC11)
TX_LED: R91.1 U3.35(PB14)
USART1_RX: R35.2 U3.59(PB7)
USART1_TX: R38.2 U3.58(PB6)
USART2_CTS: U3.14(PA0) U7.16(B4)
USART2_RTS: U3.15(PA1) U7.17(B3)
USART2_RX: U3.17(PA3) U7.20(B1)
USART2_TX: U3.16(PA2) U7.18(B2)
USART3_RX: U1.2(TXD) U3.30(PB11)
USART3_TX: U1.3(RXD) U3.29(PB10)
USB_DM: R64.2 TP4.T
USB_DP: R65.2 TP5.T
USB_FS_DM: R80.2 U3.44(PA11)
USB_FS_DP: R81.2 U3.45(PA12)
USB_FS_VBUS: R22.2 U3.42(PA9)
USB_VBUS: TP3.T U4.17(VUSB_DET)
USIM_CLK: R49.1 U4.38(SIM_CLK)
USIM_DATA: R57.1 U4.39(SIM_IO)
USIM_RST: R48.1 U4.40(SIM_RST)
USIM_VDD: D8.2 J6.P1(VCC) J6.P1B(VCC) R37.1 U4.41(VSIM)
VBAT: C88.1 C89.1 D25.- J10.+ R104.2 TP17.T U6.14(BATT)
VCC_RF: R8.1 U1.14(VCC_RF)
VDD_3V3: C56.2 C57.2 C58.2 C59.2 C60.2 C61.2 C62.2 C63.2 C64.2 C65.2 C71.2 C72.2 C85.2 D4.+ D15.+ D20.+ D21.+ J8.1 L5.1 L6.2 Q1.2(S) Q3.2(S) Q10.2(S) Q13.2(S) R1.2 R14.2 R17.2 R23.2 R26.1 R42.2 R43.2 R61.2 R63.2 R66.2 R76.2 R77.2 R83.2 R84.2 TP10.T U3.1(VBAT) U3.19(VDD) U3.32(VDD) U3.48(VDD) U3.64(VDD) U5.5(OUT) U7.19(VCCB)
VDD_3V3_B: C51.1 Q10.3(D) R18.2 R19.2 R40.2 R41.2 R70.2
VDD_3V3_RGB: C68.1 Q13.3(D) R90.1
VDD_3V3_SD: C10.1 C50.2 J6.T4(VDD) Q3.3(D) R28.1 R29.1 R30.1 R31.1 R32.1 R33.1
VDD_GNSS: C1.1 C2.1 Q1.3(D) R3.2 U1.7(VCC_IO) U1.8(VCC)
VDDA/VREF+: C32.1 C66.2 C67.2 L5.2 U3.13(VDDA/VREF+)
VLTE: C23.+ C24.+ C25.2 C26.2 C27.2 C28.2 D1.- Q4.3(D) U4.51(VCC) U4.52(VCC) U4.53(VCC)
VSYS: C4.2 C69.2 C70.2 C74.2 C78.2 C79.2 C80.2 L7.2 Q4.2(S) R20.2 R82.1 R98.2 TP16.T U5.2(VIN) U6.13(SYS)
Unconnected: J6.P6(VPP) J6.P6B(VPP) J9.4(ID) K1.1(A0) K1.3(B0) K2.1(A0) K2.3(B0) K3.1(A0) K3.3(B0) LED1.1(DOUT) U1.15(RESERVED) U1.16(SDA) U1.17(SCL) U1.18(SAFEBOOT_N) U3.2(PC13) U3.25(PC5) U3.43(PA10) U4.2(RSVD) U4.6(DSR) U4.7(RI) U4.8(DCD) U4.19(GPIO6) U4.26(SDA) U4.27(SCL) U4.31(RSVD) U4.33(RSVD) U4.34(I2S_WA/SPI_MOSI) U4.35(I2S_TXD/SPI_CS) U4.36(I2S_CLK/SPI_CLK) U4.37(I2S_RXD/SPI_MISO) U4.42(GPIO5) U4.44(SDIO_D2) U4.45(SDIO_CLK) U4.46(SDIO_CMD) U4.47(SDIO_D0) U4.48(SDIO_D3) U4.49(SDIO_D1) U6.10(!ACOK) U7.6(A5) U7.7(A6) U7.8(A7) U7.9(A8) U7.12(B8) U7.13(B7) U7.14(B6) U7.15(B5)

## Notes on the sheet
- v1.0 | Initial release | 2017/7/24 | Myer
- Impedance of RF trace should be controlled by 
  50 ohm and the length should be kept as short 
  as possible.
- SARA_R410_MODULE
- D38
- D20 | A6
- Impedance of RF trace should be controlled by 
  50 ohm and the length should be kept as short 
  as possible.
- 4.26V
- UART | A4
- 70mA
- I2C
- close to VDD | close to VBAT | close to VDDA/VREF+
- 2A
- USB input current limit
- M0 | M1 | Mode
- ≥4.5V
- Low | Low | USB 2.0(450mA)
- Low | High | USB 3.0(825mA)
- 5V/2A
- High | Low | Programmable
- High/Float | High/Float | Default(2A)
- 4.26V
- !ACOK | !CHGOK | Charger Status
- low | low
- In charging,
  supplement
  mode
- if charging, LED on.
  if charging ok, LED off.
  if blinking, BAT ERROR
- low | high
- End of charge,
  disable charger
- close to pin3
- low
- blinking
  6Hz
- NTC fault,
  timer out
- high | high
- VIN absent,
  !EN! disable,
  thermal shutdown
- Charge Current:690mA
- close to BAT

## Library data of the parts
ANT1 ANT2 = Connector-new:ANTENNA-U-FL: 320110048
C1-C22 C25-C90 = Discrete-small:C*: Ceramic Capacitors
C23 C24 = Discrete-new:CAP-POLAR: Electrolytic Capacitors,Tantalum Capacitors and Super Capacitors
D1 D25 = Discrete-new:D-ZENER-2P: SOD-123:304030008;SOT-23:304030000
D2 D4 D15 D20 D21 D23 = Discrete-new:LED
D3 D5-D14 D16-D19 D22 D24 = Discrete-new:D-ESD-2P-DOUBLE
F1 = Discrete-new:FUSE
FR1-FR8 = moudle-new:SEEEDSTUDIO-OPEN-SCH-FRAME
J1-J5 J7 = Connector-new:GROVE-CONNECTOR-SMD: 4P-SMD-2.0:320110030;4P-SMD-2.0-90D:320110032
J6 = Connector-new:NANO_SIM+TF-24P
J8 = Connector-new:HEADER-5P
J9 = Connector-new:MICRO-USB5+4P: 5+4P-SMD-0.65-B:320010000;5+2P-SMD-0.65-AB:340032001;5+5P-SMD-0.65-7.2X5.06MM:320010050;
J10 = Connector-new:JST-2P-SMD: 2P-SMD-1.0-90D:320110054;2P-SMD-2.0-90D:320110026
K1-K3 = Discrete-new:BUTTON-4P: SW4-6.0X6.0X5.0MM:311020024;SW4-8.0X8.0X9.0MM:311020028;SW4-SMD-6.0X6.0X5.0MM:311020004;SW4-SMD-3.35X3.35X1.5MM:311020030;SW4-SMD-5.2X5.2X2.5MM:311020046
L1 L5 L7 = Discrete-new:INDUCTOR/FERRITE-BEAD
L3 L4 = Discrete-small:L
L6 = Discrete-new:L
LED1 = Discrete-new:LED-RGB-4P-SK6812
Q1 Q3 Q4 Q10 Q13 = Discrete-new:MOSFET-P
Q2 Q5-Q9 Q11 Q12 Q14 = Discrete-new:MOSFET-N
R1-R8 R10-R109 = Discrete-small:R*
TP1-TP5 TP7-TP17 TP19 = Discrete-new:TEST-POINT; PARTNO: DNP
U1 = moudle-new:MOUDLE-GPS-MAX-M8: ublox MAX-M8 GPS module; MPN: MAX-M8; VALUE: MAX-M8
U3 = IC-new:MCU-STM32F412-64P
U4 = moudle-new:MOUDLE-GSM/EGPRS-SARA-R4
U5 = IC-new:PMIC-MP2161
U6 = IC-new:PMIC-MP2617
U7 = IC-new:LOGIC-TXS0108EPWR: 310050026
X1 = Discrete-new:CRYSTAL-2P
X2 = Discrete-new:CRYSTAL-RESONATOR: Resonator Small SMD resonator. This is the itty bitty 10/20MHz resonators with built in caps. CSTCE10M0G55 and CSTCE20M0V53. Footprint has been reviewed closely but hasn't been tested yet.